# Altium schematic sheet yard-ice-cpu.SchDoc: Yard-Ice-CPU
size 365 x 274 mm; Revision: 0.2; SheetNumber: 3; SheetTotal: 5
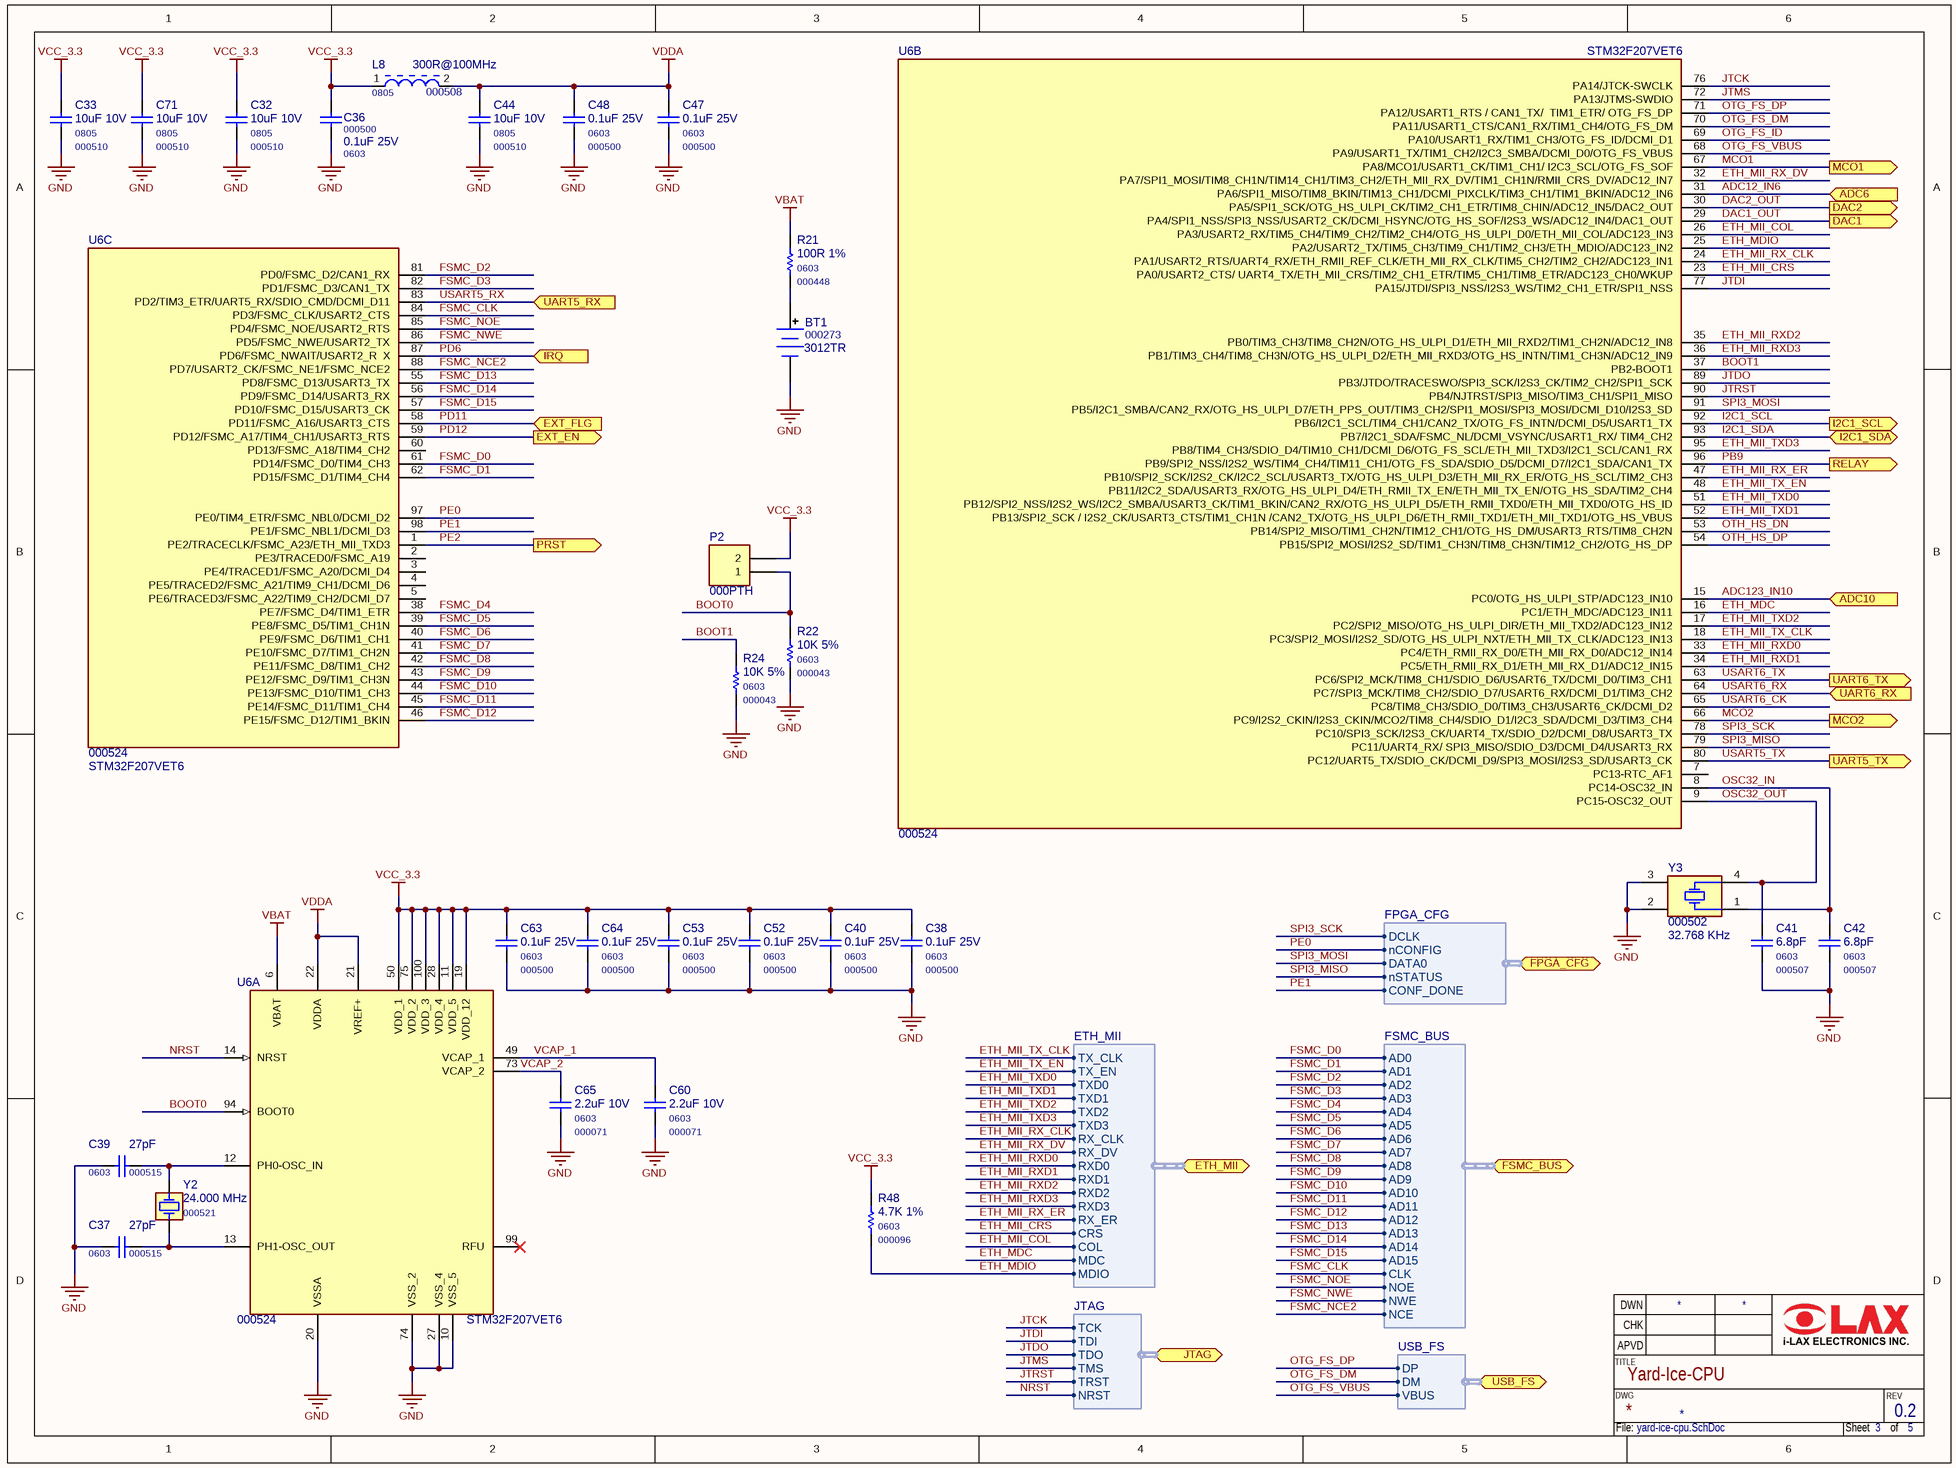
[diagram p0: yard-ice-cpu.SchDoc]

## Parts
BT1  000273  value 3012TR  [3012TR]
C32  000510  value 10uF 10V  Package: 0805  [C0805M]
C33  000510  value 10uF 10V  Package: 0805  [C0805M]
C36  000500  value 0.1uF 25V  Package: 0603  [C0603M]
C37  000515  value 27pF  Package: 0603  [C0603M]
C38  000500  value 0.1uF 25V  Package: 0603  [C0603M]
C39  000515  value 27pF  Package: 0603  [C0603M]
C40  000500  value 0.1uF 25V  Package: 0603  [C0603M]
C41  000507  value 6.8pF  Package: 0603  [C0603M]
C42  000507  value 6.8pF  Package: 0603  [C0603M]
C44  000510  value 10uF 10V  Package: 0805  [C0805M]
C47  000500  value 0.1uF 25V  Package: 0603  [C0603M]
C48  000500  value 0.1uF 25V  Package: 0603  [C0603M]
C52  000500  value 0.1uF 25V  Package: 0603  [C0603M]
C53  000500  value 0.1uF 25V  Package: 0603  [C0603M]
C60  000071  value 2.2uF 10V  Package: 0603  [C0603M]
C63  000500  value 0.1uF 25V  Package: 0603  [C0603M]
C64  000500  value 0.1uF 25V  Package: 0603  [C0603M]
C65  000071  value 2.2uF 10V  Package: 0603  [C0603M]
C71  000510  value 10uF 10V  Package: 0805  [C0805M]
L8  000508  value 300R@100MHz  Package: 0805  [L0805M]
P2  000PTH  [TSW-102-07-G-S]
R21  000448  value 100R 1%  Package: 0603  [R0603M]
R22  000043  value 10K 5%  Package: 0603  [R0603M]
R24  000043  value 10K 5%  Package: 0603  [R0603M]
R48  000096  value 4.7K 1%  Package: 0603  [R0603M]
U6  000524  value STM32F207VET6  [LQFP100]  (parts A,B,C of 3)
Y2  000521  value 24.000 MHz  [ABM3-H]
Y3  000502  value 32.768 KHz  [ABS25]

## Ports
ADC6 (in), ADC10 (in), DAC1 (out), DAC2 (out), ETH_MII (harness ETH_MII), EXT_EN (out), EXT_FLG (in), FPGA_CFG (harness FPGA_CFG), FSMC_BUS (harness FSMC_BUS), I2C1_SCL (out), I2C1_SDA (bidir), IRQ (in), JTAG (harness JTAG), MCO1 (out), MCO2 (out), PRST (out), RELAY (out), UART5_RX (in), UART5_TX (out), UART6_RX (in), UART6_TX (out), USB_FS (harness USB_FS)

## Harnesses
ETH_MII: TX_CLK, TX_EN, TXD0, TXD1, TXD2, TXD3, RX_CLK, RX_DV, RXD0, RXD1, RXD2, RXD3, RX_ER, CRS, COL, MDC, MDIO
FSMC_BUS: AD0, AD1, AD2, AD3, AD4, AD5, AD6, AD7, AD8, AD9, AD10, AD11, AD12, AD13, AD14, AD15, CLK, NOE, NWE, NCE
FPGA_CFG: CONF_DONE, nSTATUS, DATA0, nCONFIG, DCLK
USB_FS: VBUS, DM, DP
JTAG: TDO, TDI, TCK, TMS, TRST, NRST

## Nets
GND: BT1.2(-) C32.2 C33.2 C36.2 C37.1 C38.2 C39.1 C40.2 C41.1 C42.1 C44.2 C47.2 C48.2 C52.2 C53.2 C60.2 C63.2 C64.2 C65.2 C71.2 R22.1 R24.1 U6.10(VSS_5) U6.20(VSSA) U6.27(VSS_4) U6.74(VSS_2) Y3.2 Y3.3
VBAT: R21.2 U6.6(VBAT)
VCC_3.3: C32.1 C33.1 C36.1 C38.1 C40.1 C52.1 C53.1 C63.1 C64.1 C71.1 L8.1 P2.2 R48.2 U6.11(VDD_5) U6.19(VDD_12) U6.28(VDD_4) U6.50(VDD_1) U6.75(VDD_2) U6.100(VDD_3)
VDDA: C44.1 C47.1 C48.1 L8.2 U6.21(VREF+) U6.22(VDDA)
ADC12_IN6: U6.31(PA6/SPI1_MISO/TIM8_BKIN/TIM13_CH1/DCMI_PIXCLK/TIM3_CH1/TIM1_BKIN/ADC12_IN6) ; port ADC6
ADC123_IN10: U6.15(PC0/OTG_HS_ULPI_STP/ADC123_IN10) ; port ADC10
BOOT0: P2.1 R22.2 U6.94(BOOT0)
BOOT1: R24.2 U6.37(PB2-BOOT1)
DAC1_OUT: U6.29(PA4/SPI1_NSS/SPI3_NSS/USART2_CK/DCMI_HSYNC/OTG_HS_SOF/I2S3_WS/ADC12_IN4/DAC1_OUT) ; port DAC1
DAC2_OUT: U6.30(PA5/SPI1_SCK/OTG_HS_ULPI_CK/TIM2_CH1_ETR/TIM8_CHIN/ADC12_IN5/DAC2_OUT) ; port DAC2
ETH_MDC: U6.16(PC1/ETH_MDC/ADC123_IN11) ; port ETH_MII.MDC
ETH_MDIO: R48.1 U6.25(PA2/USART2_TX/TIM5_CH3/TIM9_CH1/TIM2_CH3/ETH_MDIO/ADC123_IN2) ; port ETH_MII.MDIO
ETH_MII_COL: U6.26(PA3/USART2_RX/TIM5_CH4/TIM9_CH2/TIM2_CH4/OTG_HS_ULPI_D0/ETH_MII_COL/ADC123_IN3) ; port ETH_MII.COL
ETH_MII_CRS: U6.23(PA0/USART2_CTS/_UART4_TX/ETH_MII_CRS/TIM2_CH1_ETR/TIM5_CH1/TIM8_ETR/ADC123_CH0/WKUP) ; port ETH_MII.CRS
ETH_MII_RX_CLK: U6.24(PA1/USART2_RTS/UART4_RX/ETH_RMII_REF_CLK/ETH_MII_RX_CLK/TIM5_CH2/TIM2_CH2/ADC123_IN1) ; port ETH_MII.RX_CLK
ETH_MII_RX_DV: U6.32(PA7/SPI1_MOSI/TIM8_CH1N/TIM14_CH1/TIM3_CH2/ETH_MII_RX_DV/TIM1_CH1N/RMII_CRS_DV/ADC12_IN7) ; port ETH_MII.RX_DV
ETH_MII_RX_ER: U6.47(PB10/SPI2_SCK/I2S2_CK/I2C2_SCL/USART3_TX/OTG_HS_ULPI_D3/ETH_MII_RX_ER/OTG_HS_SCL/TIM2_CH3) ; port ETH_MII.RX_ER
ETH_MII_RXD0: U6.33(PC4/ETH_RMII_RX_D0/ETH_MII_RX_D0/ADC12_IN14) ; port ETH_MII.RXD0
ETH_MII_RXD1: U6.34(PC5/ETH_RMII_RX_D1/ETH_MII_RX_D1/ADC12_IN15) ; port ETH_MII.RXD1
ETH_MII_RXD2: U6.35(PB0/TIM3_CH3/TIM8_CH2N/OTG_HS_ULPI_D1/ETH_MII_RXD2/TIM1_CH2N/ADC12_IN8) ; port ETH_MII.RXD2
ETH_MII_RXD3: U6.36(PB1/TIM3_CH4/TIM8_CH3N/OTG_HS_ULPI_D2/ETH_MII_RXD3/OTG_HS_INTN/TIM1_CH3N/ADC12_IN9) ; port ETH_MII.RXD3
ETH_MII_TX_CLK: U6.18(PC3/SPI2_MOSI/I2S2_SD/OTG_HS_ULPI_NXT/ETH_MII_TX_CLK/ADC123_IN13) ; port ETH_MII.TX_CLK
ETH_MII_TX_EN: U6.48(PB11/I2C2_SDA/USART3_RX/OTG_HS_ULPI_D4/ETH_RMII_TX_EN/ETH_MII_TX_EN/OTG_HS_SDA/TIM2_CH4) ; port ETH_MII.TX_EN
ETH_MII_TXD0: U6.51(PB12/SPI2_NSS/I2S2_WS/I2C2_SMBA/USART3_CK/TIM1_BKIN/CAN2_RX/OTG_HS_ULPI_D5/ETH_RMII_TXD0/ETH_MII_TXD0/OTG_HS_ID) ; port ETH_MII.TXD0
ETH_MII_TXD1: U6.52(PB13/SPI2_SCK_/_I2S2_CK/USART3_CTS/TIM1_CH1N_/CAN2_TX/OTG_HS_ULPI_D6/ETH_RMII_TXD1/ETH_MII_TXD1/OTG_HS_VBUS) ; port ETH_MII.TXD1
ETH_MII_TXD2: U6.17(PC2/SPI2_MISO/OTG_HS_ULPI_DIR/ETH_MII_TXD2/ADC123_IN12) ; port ETH_MII.TXD2
ETH_MII_TXD3: U6.95(PB8/TIM4_CH3/SDIO_D4/TIM10_CH1/DCMI_D6/OTG_FS_SCL/ETH_MII_TXD3/I2C1_SCL/CAN1_RX) ; port ETH_MII.TXD3
FSMC_CLK: U6.84(PD3/FSMC_CLK/USART2_CTS) ; port FSMC_BUS.CLK
FSMC_D0: U6.61(PD14/FSMC_D0/TIM4_CH3) ; port FSMC_BUS.AD0
FSMC_D1: U6.62(PD15/FSMC_D1/TIM4_CH4) ; port FSMC_BUS.AD1
FSMC_D2: U6.81(PD0/FSMC_D2/CAN1_RX) ; port FSMC_BUS.AD2
FSMC_D3: U6.82(PD1/FSMC_D3/CAN1_TX) ; port FSMC_BUS.AD3
FSMC_D4: U6.38(PE7/FSMC_D4/TIM1_ETR) ; port FSMC_BUS.AD4
FSMC_D5: U6.39(PE8/FSMC_D5/TIM1_CH1N) ; port FSMC_BUS.AD5
FSMC_D6: U6.40(PE9/FSMC_D6/TIM1_CH1) ; port FSMC_BUS.AD6
FSMC_D7: U6.41(PE10/FSMC_D7/TIM1_CH2N) ; port FSMC_BUS.AD7
FSMC_D8: U6.42(PE11/FSMC_D8/TIM1_CH2) ; port FSMC_BUS.AD8
FSMC_D9: U6.43(PE12/FSMC_D9/TIM1_CH3N) ; port FSMC_BUS.AD9
FSMC_D10: U6.44(PE13/FSMC_D10/TIM1_CH3) ; port FSMC_BUS.AD10
FSMC_D11: U6.45(PE14/FSMC_D11/TIM1_CH4) ; port FSMC_BUS.AD11
FSMC_D12: U6.46(PE15/FSMC_D12/TIM1_BKIN) ; port FSMC_BUS.AD12
FSMC_D13: U6.55(PD8/FSMC_D13/USART3_TX) ; port FSMC_BUS.AD13
FSMC_D14: U6.56(PD9/FSMC_D14/USART3_RX) ; port FSMC_BUS.AD14
FSMC_D15: U6.57(PD10/FSMC_D15/USART3_CK) ; port FSMC_BUS.AD15
FSMC_NCE2: U6.88(PD7/USART2_CK/FSMC_NE1/FSMC_NCE2) ; port FSMC_BUS.NCE
FSMC_NOE: U6.85(PD4/FSMC_NOE/USART2_RTS) ; port FSMC_BUS.NOE
FSMC_NWE: U6.86(PD5/FSMC_NWE/USART2_TX) ; port FSMC_BUS.NWE
I2C1_SCL: U6.92(PB6/I2C1_SCL/TIM4_CH1/CAN2_TX/OTG_FS_INTN/DCMI_D5/USART1_TX) ; port I2C1_SCL
I2C1_SDA: U6.93(PB7/I2C1_SDA/FSMC_NL/DCMI_VSYNC/USART1_RX/_TIM4_CH2) ; port I2C1_SDA
JTCK: U6.76(PA14/JTCK-SWCLK) ; port JTAG.TCK
JTDI: U6.77(PA15/JTDI/SPI3_NSS/I2S3_WS/TIM2_CH1_ETR/SPI1_NSS) ; port JTAG.TDI
JTDO: U6.89(PB3/JTDO/TRACESWO/SPI3_SCK/I2S3_CK/TIM2_CH2/SPI1_SCK) ; port JTAG.TDO
JTMS: U6.72(PA13/JTMS-SWDIO) ; port JTAG.TMS
JTRST: U6.90(PB4/NJTRST/SPI3_MISO/TIM3_CH1/SPI1_MISO) ; port JTAG.TRST
MCO1: U6.67(PA8/MCO1/USART1_CK/TIM1_CH1/_I2C3_SCL/OTG_FS_SOF) ; port MCO1
MCO2: U6.66(PC9/I2S2_CKIN/I2S3_CKIN/MCO2/TIM8_CH4/SDIO_D1/I2C3_SDA/DCMI_D3/TIM3_CH4) ; port MCO2
NRST: U6.14(NRST) ; port JTAG.NRST
OSC32_IN: C42.2 U6.8(PC14-OSC32_IN) Y3.1
OSC32_OUT: C41.2 U6.9(PC15-OSC32_OUT) Y3.4
OTG_FS_DM: U6.70(PA11/USART1_CTS/CAN1_RX/TIM1_CH4/OTG_FS_DM) ; port USB_FS.DM
OTG_FS_DP: U6.71(PA12/USART1_RTS_/_CAN1_TX/__TIM1_ETR/_OTG_FS_DP) ; port USB_FS.DP
OTG_FS_ID: U6.69(PA10/USART1_RX/TIM1_CH3/OTG_FS_ID/DCMI_D1)
OTG_FS_VBUS: U6.68(PA9/USART1_TX/TIM1_CH2/I2C3_SMBA/DCMI_D0/OTG_FS_VBUS) ; port USB_FS.VBUS
OTH_HS_DN: U6.53(PB14/SPI2_MISO/TIM1_CH2N/TIM12_CH1/OTG_HS_DM/USART3_RTS/TIM8_CH2N)
OTH_HS_DP: U6.54(PB15/SPI2_MOSI/I2S2_SD/TIM1_CH3N/TIM8_CH3N/TIM12_CH2/OTG_HS_DP)
PB9: U6.96(PB9/SPI2_NSS/I2S2_WS/TIM4_CH4/TIM11_CH1/OTG_FS_SDA/SDIO_D5/DCMI_D7/I2C1_SDA/CAN1_TX) ; port RELAY
PD6: U6.87(PD6/FSMC_NWAIT/USART2_R__X) ; port IRQ
PD11: U6.58(PD11/FSMC_A16/USART3_CTS) ; port EXT_FLG
PD12: U6.59(PD12/FSMC_A17/TIM4_CH1/USART3_RTS) ; port EXT_EN
PE0: U6.97(PE0/TIM4_ETR/FSMC_NBL0/DCMI_D2) ; port FPGA_CFG.nCONFIG
PE1: U6.98(PE1/FSMC_NBL1/DCMI_D3) ; port FPGA_CFG.CONF_DONE
PE2: U6.1(PE2/TRACECLK/FSMC_A23/ETH_MII_TXD3) ; port PRST
SPI3_MISO: U6.79(PC11/UART4_RX/_SPI3_MISO/SDIO_D3/DCMI_D4/USART3_RX) ; port FPGA_CFG.nSTATUS
SPI3_MOSI: U6.91(PB5/I2C1_SMBA/CAN2_RX/OTG_HS_ULPI_D7/ETH_PPS_OUT/TIM3_CH2/SPI1_MOSI/SPI3_MOSI/DCMI_D10/I2S3_SD) ; port FPGA_CFG.DATA0
SPI3_SCK: U6.78(PC10/SPI3_SCK/I2S3_CK/UART4_TX/SDIO_D2/DCMI_D8/USART3_TX) ; port FPGA_CFG.DCLK
USART5_RX: U6.83(PD2/TIM3_ETR/UART5_RX/SDIO_CMD/DCMI_D11) ; port UART5_RX
USART5_TX: U6.80(PC12/UART5_TX/SDIO_CK/DCMI_D9/SPI3_MOSI/I2S3_SD/USART3_CK) ; port UART5_TX
USART6_CK: U6.65(PC8/TIM8_CH3/SDIO_D0/TIM3_CH3/USART6_CK/DCMI_D2)
USART6_RX: U6.64(PC7/SPI3_MCK/TIM8_CH2/SDIO_D7/USART6_RX/DCMI_D1/TIM3_CH2) ; port UART6_RX
USART6_TX: U6.63(PC6/SPI2_MCK/TIM8_CH1/SDIO_D6/USART6_TX/DCMI_D0/TIM3_CH1) ; port UART6_TX
VCAP_1: C60.1 U6.49(VCAP_1)
VCAP_2: C65.1 U6.73(VCAP_2)
NetBT1_1: BT1.1(+) R21.1
NetC37_2: C37.2 U6.13(PH1-OSC_OUT) Y2.2
NetC39_2: C39.2 U6.12(PH0-OSC_IN) Y2.1

Not connected (* = marked no-connect by the designer): U6 2(PE3/TRACED0/FSMC_A19) 3(PE4/TRACED1/FSMC_A20/DCMI_D4) 4(PE5/TRACED2/FSMC_A21/TIM9_CH1/DCMI_D6) 5(PE6/TRACED3/FSMC_A22/TIM9_CH2/DCMI_D7) 7(PC13-RTC_AF1) 60(PD13/FSMC_A18/TIM4_CH2) 99(RFU)*

## Notes on the sheet
- TITLE
- APVD
- DWN
- CHK
- DWG
- REV
- File:
- Sheet
- of

## Library data of the parts
BT1 = 3012TR: CR1620 SMD Battery Holder; MF: Kestone; PN: 000273; Package: SMT
C32 C33 C71 = C0805: SMD Ceramic Chip Capacitor - 0805 - X7R; MF PN: C2012X7R1A106K; PN: TDK; PN: 000510; MF: TDK
C36 C38 C40 C47 C48 C52 C53 C63 C64 = C0603: SMD Ceramic Chip Capacitor - 0603 - X7R; MF PN: C1608X7R1E104K; MF: TDK; PN: 000500
C37 C39 C41 C42 = C0603: SMD Ceramic Chip Capacitor - 0603
  C37 C39: PN: 000515
  C41 C42: PN: 000507
C44 = C0805: SMD Ceramic Chip Capacitor - 0805 - X7R; MF PN: C2012X7R1A106K; MF: TDK; PN: 000510
C60 C65 = C0603: SMD Ceramic Chip Capacitor - 0603 - X7R; MF: Taiyo Yuden; MF PN: LMK107B7225KA-T; PN: 000071
L8 = L0805: SMD Ferrite Bead 0805; MF PN: MMZ2012Y301B; MF: TDK; PN: 000508
P2 = Header 2: Header, 2-Pin; Value: 2x1; PN: 000PTH; Package: PTH
R21 R22 R24 R48 = R0603: SMD Chip Resistor - 0603
  R21: PN: 000448
  R22 R24: PN: 000043
  R48: PN: 000096
U6 = STM32F207VET6: ARM-Cortex M3 MCU, 512KB Flash/128+4KB RAM, USB, Eth; MF: ST; Package: LQFP100; PN: 000524
Y2 = ABM3: Miniature Ceramic SMD Crystal; MF: Abracon; MF PN: ABM3-24.000MHZ-B2-T; Package: ABM3; PN: 000521
Y3 = ABS25: SMD Low Frequency Crystal; MF: Abracon; MF PN: ABS25-32.768KHZ-T; PN: 000502; Package: ABS25